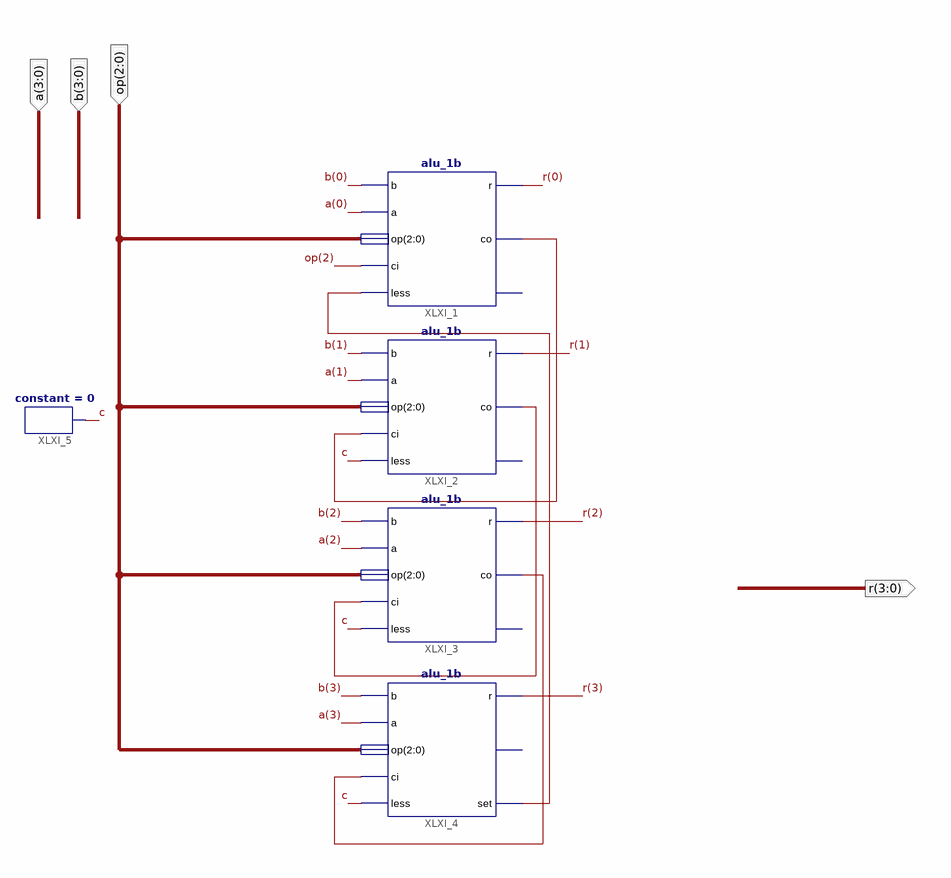
[diagram p0: schematic sheet 1]
// Xilinx ISE schematic alu_4b.sch (spartan3e) as structural Verilog: 5 symbols, 4 ports
module alu_4b (
  input  [3:0] a,
  input  [3:0] b,
  input  [2:0] op,
  output [3:0] r
);

  wire c, XLXN_1, XLXN_7, XLXN_8, XLXN_9;

  alu_1b XLXI_1 (.b(b[0]), .a(a[0]), .op(op), .ci(op[2]), .less(XLXN_1), .r(r[0]), .co(XLXN_7));  // open: set
  alu_1b XLXI_2 (.b(b[1]), .a(a[1]), .op(op), .ci(XLXN_7), .less(c), .r(r[1]), .co(XLXN_9));  // open: set
  alu_1b XLXI_3 (.b(b[2]), .a(a[2]), .op(op), .ci(XLXN_9), .less(c), .r(r[2]), .co(XLXN_8));  // open: set
  alu_1b XLXI_4 (.b(b[3]), .a(a[3]), .op(op), .ci(XLXN_8), .less(c), .r(r[3]), .set(XLXN_1));  // open: co
  constant #(.CValue("0")) XLXI_5 (.O(c));
endmodule
